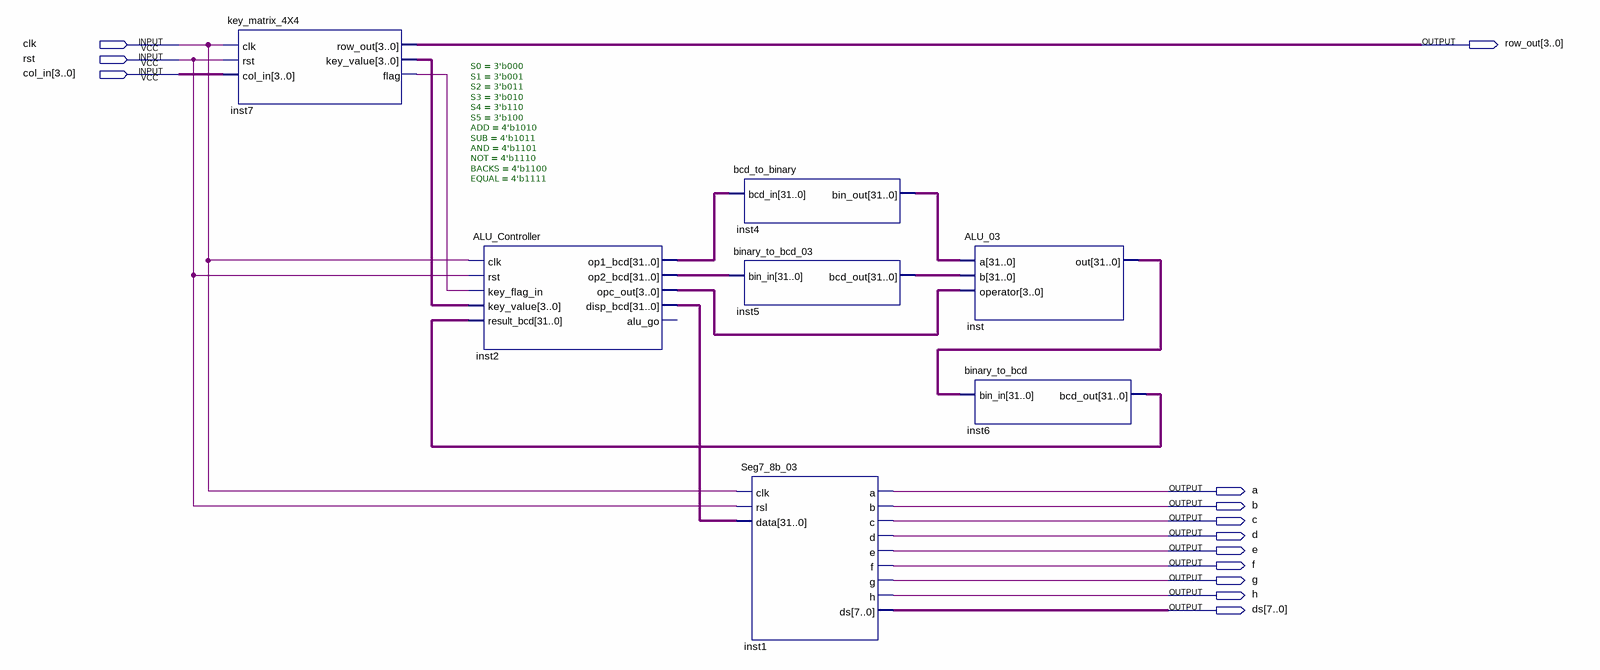
[diagram p0: schematic sheet]
// Quartus schematic myCalculator.bdf as structural Verilog: 7 symbols, 13 pins
module myCalculator (
  input  clk,
  input  rst,
  input  [3:0] col_in,
  output [3:0] row_out,
  output a,
  output b,
  output c,
  output d,
  output e,
  output f,
  output g,
  output h,
  output [7:0] ds
);

  wire inst7_flag;
  wire [3:0] inst2_opc_out, inst7_key_value;
  wire [31:0] inst2_disp_bcd, inst2_op1_bcd, inst2_op2_bcd, inst4_bin_out, inst5_bcd_out, inst6_bcd_out,
       inst_out;

  key_matrix_4X4 inst7 (
    .clk(clk), .rst(rst), .col_in(col_in), .row_out(row_out), .key_value(inst7_key_value), .flag(inst7_flag));
  ALU_Controller #(.S0(3'b000), .S1(3'b001), .S2(3'b011), .S3(3'b010), .S4(3'b110), .S5(3'b100), .ADD(4'b1010), .SUB(4'b1011), .AND(4'b1101), .NOT(4'b1110), .BACKS(4'b1100), .EQUAL(4'b1111)) inst2 (
    .clk(clk), .rst(rst), .key_flag_in(inst7_flag), .key_value(inst7_key_value), .result_bcd(inst6_bcd_out),
    .op1_bcd(inst2_op1_bcd), .op2_bcd(inst2_op2_bcd), .opc_out(inst2_opc_out), .disp_bcd(inst2_disp_bcd));  // open: alu_go
  bcd_to_binary inst4 (.bcd_in(inst2_op1_bcd), .bin_out(inst4_bin_out));
  binary_to_bcd_03 inst5 (.bin_in(inst2_op2_bcd), .bcd_out(inst5_bcd_out));
  Seg7_8b_03 inst1 (
    .clk(clk), .rsl(rst), .data(inst2_disp_bcd), .a(a), .b(b), .c(c), .d(d), .e(e), .f(f), .g(g), .h(h),
    .ds(ds));
  ALU_03 inst (.a(inst4_bin_out), .b(inst5_bcd_out), .operator(inst2_opc_out), .out(inst_out));
  binary_to_bcd inst6 (.bin_in(inst_out), .bcd_out(inst6_bcd_out));
endmodule
